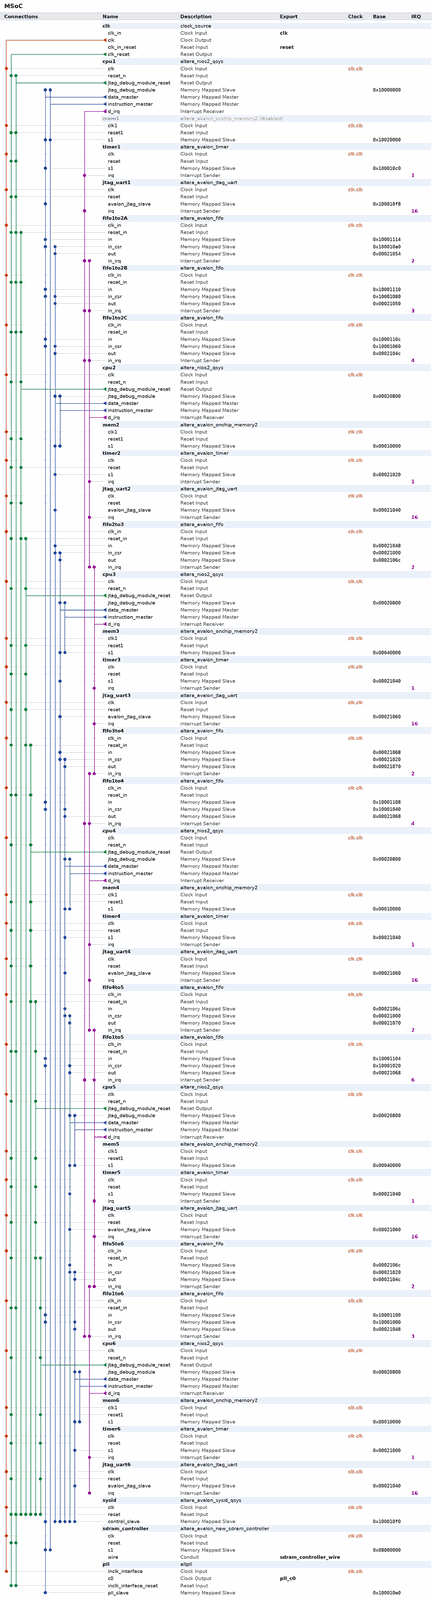
[diagram p0: system contents, whole]
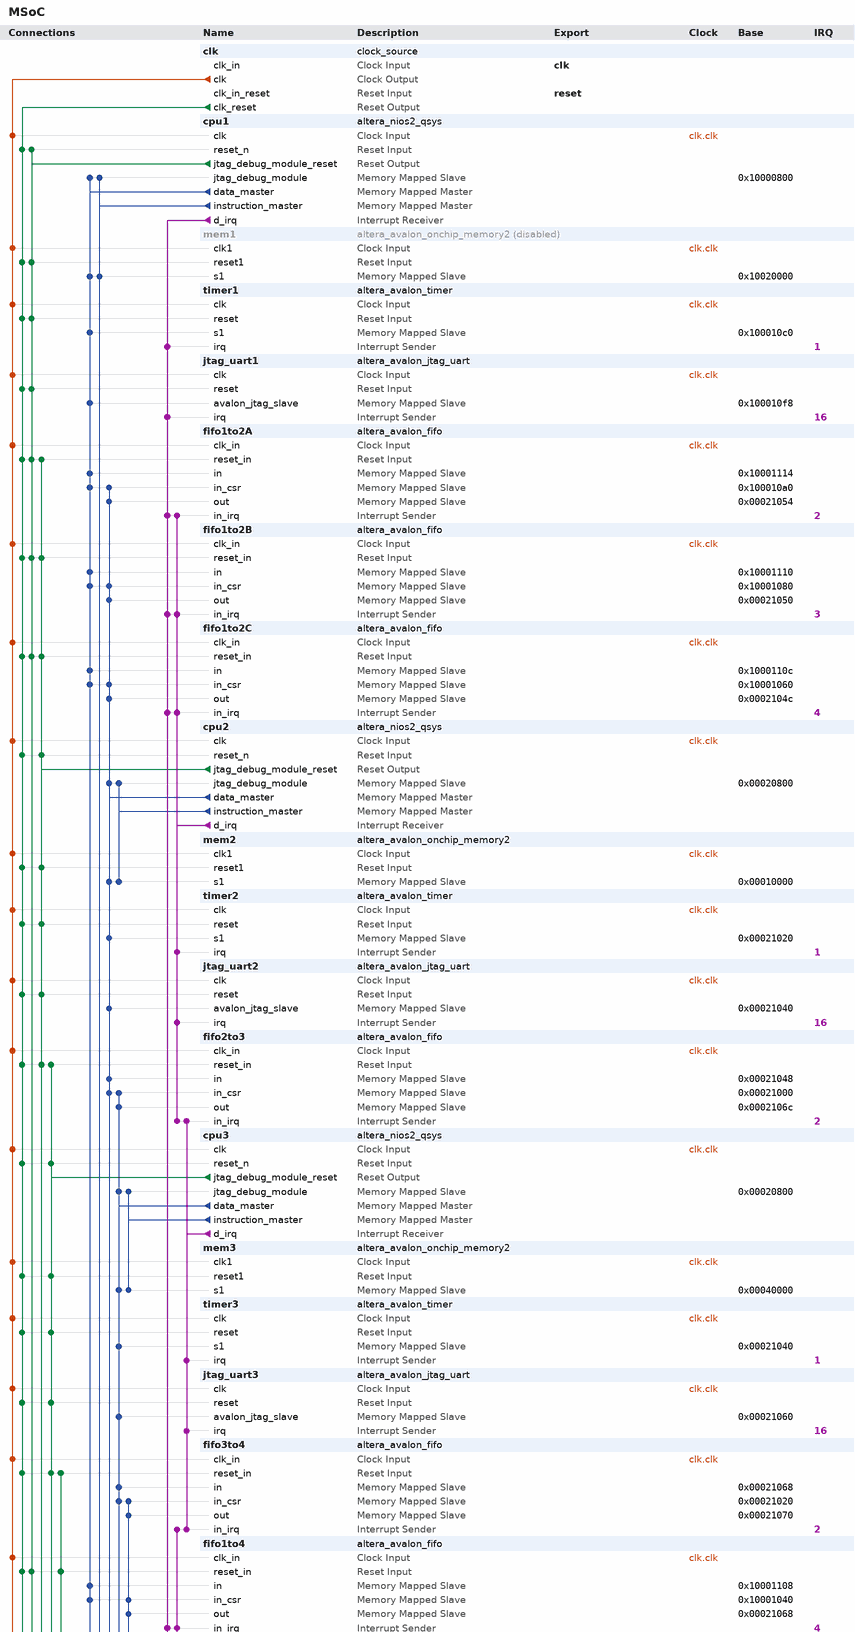
[diagram p1: system contents, upper part]
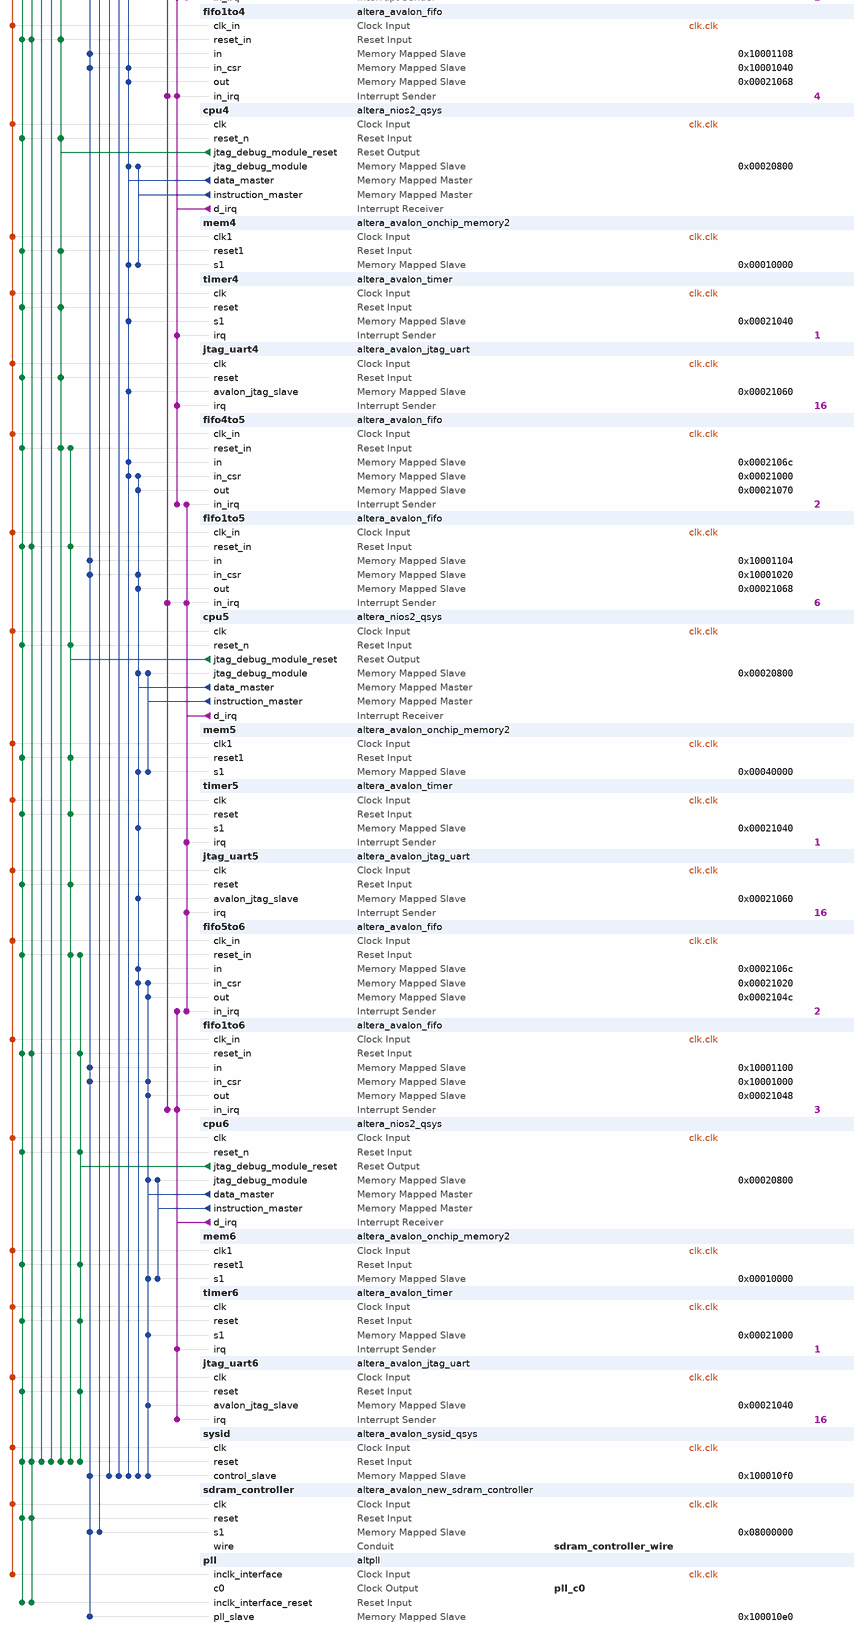
[diagram p2: system contents, lower part]
# Platform Designer (Qsys) system MSoC, Cyclone IV E EP4CE115F29C7
# Parameters at their usual value, and those the tool derives, are not listed.
package require -exact qsys 13.1
create_system MSoC
set_project_property DEVICE_FAMILY {Cyclone IV E}
set_project_property DEVICE EP4CE115F29C7

add_instance clk clock_source 13.1
set_instance_parameter_value clk clockFrequency 50000000

add_instance cpu1 altera_nios2_qsys 13.1
set_instance_parameter_value cpu1 resetSlave sdram_controller.s1
set_instance_parameter_value cpu1 mmu_TLBMissExcSlave None
set_instance_parameter_value cpu1 exceptionSlave sdram_controller.s1
set_instance_parameter_value cpu1 breakSlave cpu1.jtag_debug_module
set_instance_parameter_value cpu1 impl Tiny
set_instance_parameter_value cpu1 icache_size 4096

add_instance mem1 altera_avalon_onchip_memory2 13.1
set_instance_property mem1 ENABLED false
set_instance_parameter_value mem1 dataWidth 32
set_instance_parameter_value mem1 dualPort false
set_instance_parameter_value mem1 initMemContent true
set_instance_parameter_value mem1 initializationFileName onchip_mem.hex
set_instance_parameter_value mem1 memorySize 131072

add_instance timer1 altera_avalon_timer 13.1
set_instance_parameter_value timer1 period 1
set_instance_parameter_value timer1 periodUnits MSEC

add_instance jtag_uart1 altera_avalon_jtag_uart 13.1
set_instance_parameter_value jtag_uart1 simInteractiveOptions NO_INTERACTIVE_WINDOWS

add_instance fifo1to2A altera_avalon_fifo 13.1
set_instance_parameter_value fifo1to2A bitsPerSymbol 16
set_instance_parameter_value fifo1to2A channelWidth 8
set_instance_parameter_value fifo1to2A errorWidth 8
set_instance_parameter_value fifo1to2A fifoDepth 8
set_instance_parameter_value fifo1to2A fifoInputInterfaceOptions AVALONMM_WRITE
set_instance_parameter_value fifo1to2A fifoOutputInterfaceOptions AVALONMM_READ
set_instance_parameter_value fifo1to2A singleClockMode true
set_instance_parameter_value fifo1to2A symbolsPerBeat 2
set_instance_parameter_value fifo1to2A useIRQ true
set_instance_parameter_value fifo1to2A usePacket true
set_instance_parameter_value fifo1to2A useReadControl false

add_instance fifo1to2B altera_avalon_fifo 13.1
set_instance_parameter_value fifo1to2B bitsPerSymbol 16
set_instance_parameter_value fifo1to2B channelWidth 8
set_instance_parameter_value fifo1to2B errorWidth 8
set_instance_parameter_value fifo1to2B fifoDepth 8
set_instance_parameter_value fifo1to2B fifoInputInterfaceOptions AVALONMM_WRITE
set_instance_parameter_value fifo1to2B fifoOutputInterfaceOptions AVALONMM_READ
set_instance_parameter_value fifo1to2B singleClockMode true
set_instance_parameter_value fifo1to2B symbolsPerBeat 2
set_instance_parameter_value fifo1to2B useIRQ true
set_instance_parameter_value fifo1to2B usePacket true
set_instance_parameter_value fifo1to2B useReadControl false

add_instance fifo1to2C altera_avalon_fifo 13.1
set_instance_parameter_value fifo1to2C bitsPerSymbol 16
set_instance_parameter_value fifo1to2C channelWidth 8
set_instance_parameter_value fifo1to2C errorWidth 8
set_instance_parameter_value fifo1to2C fifoDepth 8
set_instance_parameter_value fifo1to2C fifoInputInterfaceOptions AVALONMM_WRITE
set_instance_parameter_value fifo1to2C fifoOutputInterfaceOptions AVALONMM_READ
set_instance_parameter_value fifo1to2C singleClockMode true
set_instance_parameter_value fifo1to2C symbolsPerBeat 2
set_instance_parameter_value fifo1to2C useIRQ true
set_instance_parameter_value fifo1to2C usePacket true
set_instance_parameter_value fifo1to2C useReadControl false

add_instance cpu2 altera_nios2_qsys 13.1
set_instance_parameter_value cpu2 resetSlave mem2.s1
set_instance_parameter_value cpu2 mmu_TLBMissExcSlave None
set_instance_parameter_value cpu2 exceptionSlave mem2.s1
set_instance_parameter_value cpu2 breakSlave cpu2.jtag_debug_module
set_instance_parameter_value cpu2 impl Tiny
set_instance_parameter_value cpu2 icache_size 4096

add_instance mem2 altera_avalon_onchip_memory2 13.1
set_instance_parameter_value mem2 dataWidth 32
set_instance_parameter_value mem2 dualPort false
set_instance_parameter_value mem2 initMemContent true
set_instance_parameter_value mem2 initializationFileName onchip_mem.hex
set_instance_parameter_value mem2 memorySize 65536

add_instance timer2 altera_avalon_timer 13.1
set_instance_parameter_value timer2 period 1
set_instance_parameter_value timer2 periodUnits MSEC

add_instance jtag_uart2 altera_avalon_jtag_uart 13.1
set_instance_parameter_value jtag_uart2 simInteractiveOptions NO_INTERACTIVE_WINDOWS

add_instance fifo2to3 altera_avalon_fifo 13.1
set_instance_parameter_value fifo2to3 bitsPerSymbol 16
set_instance_parameter_value fifo2to3 channelWidth 8
set_instance_parameter_value fifo2to3 errorWidth 8
set_instance_parameter_value fifo2to3 fifoDepth 8
set_instance_parameter_value fifo2to3 fifoInputInterfaceOptions AVALONMM_WRITE
set_instance_parameter_value fifo2to3 fifoOutputInterfaceOptions AVALONMM_READ
set_instance_parameter_value fifo2to3 singleClockMode true
set_instance_parameter_value fifo2to3 symbolsPerBeat 2
set_instance_parameter_value fifo2to3 useIRQ true
set_instance_parameter_value fifo2to3 usePacket true
set_instance_parameter_value fifo2to3 useReadControl false

add_instance cpu3 altera_nios2_qsys 13.1
set_instance_parameter_value cpu3 resetSlave mem3.s1
set_instance_parameter_value cpu3 mmu_TLBMissExcSlave None
set_instance_parameter_value cpu3 exceptionSlave mem3.s1
set_instance_parameter_value cpu3 breakSlave cpu3.jtag_debug_module
set_instance_parameter_value cpu3 impl Tiny
set_instance_parameter_value cpu3 icache_size 4096

add_instance mem3 altera_avalon_onchip_memory2 13.1
set_instance_parameter_value mem3 dataWidth 32
set_instance_parameter_value mem3 dualPort false
set_instance_parameter_value mem3 initMemContent true
set_instance_parameter_value mem3 initializationFileName onchip_mem.hex
set_instance_parameter_value mem3 memorySize 94208

add_instance timer3 altera_avalon_timer 13.1
set_instance_parameter_value timer3 period 1
set_instance_parameter_value timer3 periodUnits MSEC

add_instance jtag_uart3 altera_avalon_jtag_uart 13.1
set_instance_parameter_value jtag_uart3 simInteractiveOptions NO_INTERACTIVE_WINDOWS

add_instance fifo3to4 altera_avalon_fifo 13.1
set_instance_parameter_value fifo3to4 bitsPerSymbol 16
set_instance_parameter_value fifo3to4 channelWidth 8
set_instance_parameter_value fifo3to4 errorWidth 8
set_instance_parameter_value fifo3to4 fifoDepth 8
set_instance_parameter_value fifo3to4 fifoInputInterfaceOptions AVALONMM_WRITE
set_instance_parameter_value fifo3to4 fifoOutputInterfaceOptions AVALONMM_READ
set_instance_parameter_value fifo3to4 singleClockMode true
set_instance_parameter_value fifo3to4 symbolsPerBeat 2
set_instance_parameter_value fifo3to4 useIRQ true
set_instance_parameter_value fifo3to4 usePacket true
set_instance_parameter_value fifo3to4 useReadControl false

add_instance fifo1to4 altera_avalon_fifo 13.1
set_instance_parameter_value fifo1to4 bitsPerSymbol 16
set_instance_parameter_value fifo1to4 channelWidth 8
set_instance_parameter_value fifo1to4 errorWidth 8
set_instance_parameter_value fifo1to4 fifoDepth 8
set_instance_parameter_value fifo1to4 fifoInputInterfaceOptions AVALONMM_WRITE
set_instance_parameter_value fifo1to4 fifoOutputInterfaceOptions AVALONMM_READ
set_instance_parameter_value fifo1to4 singleClockMode true
set_instance_parameter_value fifo1to4 symbolsPerBeat 2
set_instance_parameter_value fifo1to4 useIRQ true
set_instance_parameter_value fifo1to4 usePacket true
set_instance_parameter_value fifo1to4 useReadControl false

add_instance cpu4 altera_nios2_qsys 13.1
set_instance_parameter_value cpu4 resetSlave mem4.s1
set_instance_parameter_value cpu4 mmu_TLBMissExcSlave None
set_instance_parameter_value cpu4 exceptionSlave mem4.s1
set_instance_parameter_value cpu4 breakSlave cpu4.jtag_debug_module
set_instance_parameter_value cpu4 impl Tiny
set_instance_parameter_value cpu4 icache_size 4096

add_instance mem4 altera_avalon_onchip_memory2 13.1
set_instance_parameter_value mem4 dataWidth 32
set_instance_parameter_value mem4 dualPort false
set_instance_parameter_value mem4 initMemContent true
set_instance_parameter_value mem4 initializationFileName onchip_mem.hex
set_instance_parameter_value mem4 memorySize 65536

add_instance timer4 altera_avalon_timer 13.1
set_instance_parameter_value timer4 period 1
set_instance_parameter_value timer4 periodUnits MSEC

add_instance jtag_uart4 altera_avalon_jtag_uart 13.1
set_instance_parameter_value jtag_uart4 simInteractiveOptions NO_INTERACTIVE_WINDOWS

add_instance fifo4to5 altera_avalon_fifo 13.1
set_instance_parameter_value fifo4to5 bitsPerSymbol 16
set_instance_parameter_value fifo4to5 channelWidth 8
set_instance_parameter_value fifo4to5 errorWidth 8
set_instance_parameter_value fifo4to5 fifoDepth 8
set_instance_parameter_value fifo4to5 fifoInputInterfaceOptions AVALONMM_WRITE
set_instance_parameter_value fifo4to5 fifoOutputInterfaceOptions AVALONMM_READ
set_instance_parameter_value fifo4to5 singleClockMode true
set_instance_parameter_value fifo4to5 symbolsPerBeat 2
set_instance_parameter_value fifo4to5 useIRQ true
set_instance_parameter_value fifo4to5 usePacket true
set_instance_parameter_value fifo4to5 useReadControl false

add_instance fifo1to5 altera_avalon_fifo 13.1
set_instance_parameter_value fifo1to5 bitsPerSymbol 16
set_instance_parameter_value fifo1to5 channelWidth 8
set_instance_parameter_value fifo1to5 errorWidth 8
set_instance_parameter_value fifo1to5 fifoDepth 8
set_instance_parameter_value fifo1to5 fifoInputInterfaceOptions AVALONMM_WRITE
set_instance_parameter_value fifo1to5 fifoOutputInterfaceOptions AVALONMM_READ
set_instance_parameter_value fifo1to5 singleClockMode true
set_instance_parameter_value fifo1to5 symbolsPerBeat 2
set_instance_parameter_value fifo1to5 useIRQ true
set_instance_parameter_value fifo1to5 usePacket true
set_instance_parameter_value fifo1to5 useReadControl false

add_instance cpu5 altera_nios2_qsys 13.1
set_instance_parameter_value cpu5 resetSlave mem5.s1
set_instance_parameter_value cpu5 mmu_TLBMissExcSlave None
set_instance_parameter_value cpu5 exceptionSlave mem5.s1
set_instance_parameter_value cpu5 breakSlave cpu5.jtag_debug_module
set_instance_parameter_value cpu5 impl Tiny
set_instance_parameter_value cpu5 icache_size 4096

add_instance mem5 altera_avalon_onchip_memory2 13.1
set_instance_parameter_value mem5 dataWidth 32
set_instance_parameter_value mem5 dualPort false
set_instance_parameter_value mem5 initMemContent true
set_instance_parameter_value mem5 initializationFileName onchip_mem.hex
set_instance_parameter_value mem5 memorySize 94208

add_instance timer5 altera_avalon_timer 13.1
set_instance_parameter_value timer5 period 1
set_instance_parameter_value timer5 periodUnits MSEC

add_instance jtag_uart5 altera_avalon_jtag_uart 13.1
set_instance_parameter_value jtag_uart5 simInteractiveOptions NO_INTERACTIVE_WINDOWS

add_instance fifo5to6 altera_avalon_fifo 13.1
set_instance_parameter_value fifo5to6 bitsPerSymbol 16
set_instance_parameter_value fifo5to6 channelWidth 8
set_instance_parameter_value fifo5to6 errorWidth 8
set_instance_parameter_value fifo5to6 fifoDepth 8
set_instance_parameter_value fifo5to6 fifoInputInterfaceOptions AVALONMM_WRITE
set_instance_parameter_value fifo5to6 fifoOutputInterfaceOptions AVALONMM_READ
set_instance_parameter_value fifo5to6 singleClockMode true
set_instance_parameter_value fifo5to6 symbolsPerBeat 2
set_instance_parameter_value fifo5to6 useIRQ true
set_instance_parameter_value fifo5to6 usePacket true
set_instance_parameter_value fifo5to6 useReadControl false

add_instance fifo1to6 altera_avalon_fifo 13.1
set_instance_parameter_value fifo1to6 bitsPerSymbol 16
set_instance_parameter_value fifo1to6 channelWidth 8
set_instance_parameter_value fifo1to6 errorWidth 8
set_instance_parameter_value fifo1to6 fifoDepth 8
set_instance_parameter_value fifo1to6 fifoInputInterfaceOptions AVALONMM_WRITE
set_instance_parameter_value fifo1to6 fifoOutputInterfaceOptions AVALONMM_READ
set_instance_parameter_value fifo1to6 singleClockMode true
set_instance_parameter_value fifo1to6 symbolsPerBeat 2
set_instance_parameter_value fifo1to6 useIRQ true
set_instance_parameter_value fifo1to6 usePacket true
set_instance_parameter_value fifo1to6 useReadControl false

add_instance cpu6 altera_nios2_qsys 13.1
set_instance_parameter_value cpu6 resetSlave mem6.s1
set_instance_parameter_value cpu6 mmu_TLBMissExcSlave None
set_instance_parameter_value cpu6 exceptionSlave mem6.s1
set_instance_parameter_value cpu6 breakSlave cpu6.jtag_debug_module
set_instance_parameter_value cpu6 impl Tiny
set_instance_parameter_value cpu6 icache_size 4096

add_instance mem6 altera_avalon_onchip_memory2 13.1
set_instance_parameter_value mem6 dataWidth 32
set_instance_parameter_value mem6 dualPort false
set_instance_parameter_value mem6 initMemContent true
set_instance_parameter_value mem6 initializationFileName onchip_mem.hex
set_instance_parameter_value mem6 memorySize 65536

add_instance timer6 altera_avalon_timer 13.1
set_instance_parameter_value timer6 period 1
set_instance_parameter_value timer6 periodUnits MSEC

add_instance jtag_uart6 altera_avalon_jtag_uart 13.1
set_instance_parameter_value jtag_uart6 simInteractiveOptions NO_INTERACTIVE_WINDOWS

add_instance sysid altera_avalon_sysid_qsys 13.1
set_instance_parameter_value sysid id 4

add_instance sdram_controller altera_avalon_new_sdram_controller 13.1
set_instance_parameter_value sdram_controller TAC 6.0
set_instance_parameter_value sdram_controller TRCD 20.0
set_instance_parameter_value sdram_controller TRP 20.0
set_instance_parameter_value sdram_controller casLatency 3
set_instance_parameter_value sdram_controller columnWidth 10
set_instance_parameter_value sdram_controller dataWidth 32
set_instance_parameter_value sdram_controller generateSimulationModel false
set_instance_parameter_value sdram_controller model single_Micron_MT48LC4M32B2_7_chip
set_instance_parameter_value sdram_controller numberOfBanks 4
set_instance_parameter_value sdram_controller numberOfChipSelects 1
set_instance_parameter_value sdram_controller powerUpDelay 100.0
set_instance_parameter_value sdram_controller refreshPeriod 15.625
set_instance_parameter_value sdram_controller rowWidth 13

add_instance pll altpll 13.1
set_instance_parameter_value pll INCLK0_INPUT_FREQUENCY 20000
set_instance_parameter_value pll CLK0_MULTIPLY_BY 1
set_instance_parameter_value pll CLK0_DIVIDE_BY 1
set_instance_parameter_value pll CLK0_PHASE_SHIFT -3611
set_instance_parameter_value pll PORT_clk1 PORT_UNUSED
set_instance_parameter_value pll PORT_clk2 PORT_UNUSED
set_instance_parameter_value pll PORT_clk3 PORT_UNUSED
set_instance_parameter_value pll PORT_ARESET PORT_UNUSED
set_instance_parameter_value pll PORT_LOCKED PORT_UNUSED

# connections
add_connection clk.clk cpu1.clk clock
add_connection clk.clk cpu2.clk clock
add_connection clk.clk cpu3.clk clock
add_connection clk.clk cpu4.clk clock
add_connection clk.clk cpu5.clk clock
add_connection clk.clk cpu6.clk clock
add_connection clk.clk fifo1to2A.clk_in clock
add_connection clk.clk fifo1to2B.clk_in clock
add_connection clk.clk fifo1to2C.clk_in clock
add_connection clk.clk fifo1to4.clk_in clock
add_connection clk.clk fifo1to5.clk_in clock
add_connection clk.clk fifo1to6.clk_in clock
add_connection clk.clk fifo2to3.clk_in clock
add_connection clk.clk fifo3to4.clk_in clock
add_connection clk.clk fifo4to5.clk_in clock
add_connection clk.clk fifo5to6.clk_in clock
add_connection clk.clk jtag_uart1.clk clock
add_connection clk.clk jtag_uart2.clk clock
add_connection clk.clk jtag_uart3.clk clock
add_connection clk.clk jtag_uart4.clk clock
add_connection clk.clk jtag_uart5.clk clock
add_connection clk.clk jtag_uart6.clk clock
add_connection clk.clk mem1.clk1 clock
add_connection clk.clk mem2.clk1 clock
add_connection clk.clk mem3.clk1 clock
add_connection clk.clk mem4.clk1 clock
add_connection clk.clk mem5.clk1 clock
add_connection clk.clk mem6.clk1 clock
add_connection clk.clk pll.inclk_interface clock
add_connection clk.clk sdram_controller.clk clock
add_connection clk.clk sysid.clk clock
add_connection clk.clk timer1.clk clock
add_connection clk.clk timer2.clk clock
add_connection clk.clk timer3.clk clock
add_connection clk.clk timer4.clk clock
add_connection clk.clk timer5.clk clock
add_connection clk.clk timer6.clk clock
add_connection clk.clk_reset cpu1.reset_n reset
add_connection clk.clk_reset cpu2.reset_n reset
add_connection clk.clk_reset cpu3.reset_n reset
add_connection clk.clk_reset cpu4.reset_n reset
add_connection clk.clk_reset cpu5.reset_n reset
add_connection clk.clk_reset cpu6.reset_n reset
add_connection clk.clk_reset fifo1to2A.reset_in reset
add_connection clk.clk_reset fifo1to2B.reset_in reset
add_connection clk.clk_reset fifo1to2C.reset_in reset
add_connection clk.clk_reset fifo1to4.reset_in reset
add_connection clk.clk_reset fifo1to5.reset_in reset
add_connection clk.clk_reset fifo1to6.reset_in reset
add_connection clk.clk_reset fifo2to3.reset_in reset
add_connection clk.clk_reset fifo3to4.reset_in reset
add_connection clk.clk_reset fifo4to5.reset_in reset
add_connection clk.clk_reset fifo5to6.reset_in reset
add_connection clk.clk_reset jtag_uart1.reset reset
add_connection clk.clk_reset jtag_uart2.reset reset
add_connection clk.clk_reset jtag_uart3.reset reset
add_connection clk.clk_reset jtag_uart4.reset reset
add_connection clk.clk_reset jtag_uart5.reset reset
add_connection clk.clk_reset jtag_uart6.reset reset
add_connection clk.clk_reset mem1.reset1 reset
add_connection clk.clk_reset mem2.reset1 reset
add_connection clk.clk_reset mem3.reset1 reset
add_connection clk.clk_reset mem4.reset1 reset
add_connection clk.clk_reset mem5.reset1 reset
add_connection clk.clk_reset mem6.reset1 reset
add_connection clk.clk_reset pll.inclk_interface_reset reset
add_connection clk.clk_reset sdram_controller.reset reset
add_connection clk.clk_reset sysid.reset reset
add_connection clk.clk_reset timer1.reset reset
add_connection clk.clk_reset timer2.reset reset
add_connection clk.clk_reset timer3.reset reset
add_connection clk.clk_reset timer4.reset reset
add_connection clk.clk_reset timer5.reset reset
add_connection clk.clk_reset timer6.reset reset
add_connection cpu1.jtag_debug_module_reset cpu1.reset_n reset
add_connection cpu1.jtag_debug_module_reset fifo1to2A.reset_in reset
add_connection cpu1.jtag_debug_module_reset fifo1to2B.reset_in reset
add_connection cpu1.jtag_debug_module_reset fifo1to2C.reset_in reset
add_connection cpu1.jtag_debug_module_reset fifo1to4.reset_in reset
add_connection cpu1.jtag_debug_module_reset fifo1to5.reset_in reset
add_connection cpu1.jtag_debug_module_reset fifo1to6.reset_in reset
add_connection cpu1.jtag_debug_module_reset jtag_uart1.reset reset
add_connection cpu1.jtag_debug_module_reset mem1.reset1 reset
add_connection cpu1.jtag_debug_module_reset pll.inclk_interface_reset reset
add_connection cpu1.jtag_debug_module_reset sdram_controller.reset reset
add_connection cpu1.jtag_debug_module_reset sysid.reset reset
add_connection cpu1.jtag_debug_module_reset timer1.reset reset
add_connection cpu2.jtag_debug_module_reset cpu2.reset_n reset
add_connection cpu2.jtag_debug_module_reset fifo1to2A.reset_in reset
add_connection cpu2.jtag_debug_module_reset fifo1to2B.reset_in reset
add_connection cpu2.jtag_debug_module_reset fifo1to2C.reset_in reset
add_connection cpu2.jtag_debug_module_reset fifo2to3.reset_in reset
add_connection cpu2.jtag_debug_module_reset jtag_uart2.reset reset
add_connection cpu2.jtag_debug_module_reset mem2.reset1 reset
add_connection cpu2.jtag_debug_module_reset sysid.reset reset
add_connection cpu2.jtag_debug_module_reset timer2.reset reset
add_connection cpu3.jtag_debug_module_reset cpu3.reset_n reset
add_connection cpu3.jtag_debug_module_reset fifo2to3.reset_in reset
add_connection cpu3.jtag_debug_module_reset fifo3to4.reset_in reset
add_connection cpu3.jtag_debug_module_reset jtag_uart3.reset reset
add_connection cpu3.jtag_debug_module_reset mem3.reset1 reset
add_connection cpu3.jtag_debug_module_reset sysid.reset reset
add_connection cpu3.jtag_debug_module_reset timer3.reset reset
add_connection cpu4.jtag_debug_module_reset cpu4.reset_n reset
add_connection cpu4.jtag_debug_module_reset fifo1to4.reset_in reset
add_connection cpu4.jtag_debug_module_reset fifo3to4.reset_in reset
add_connection cpu4.jtag_debug_module_reset fifo4to5.reset_in reset
add_connection cpu4.jtag_debug_module_reset jtag_uart4.reset reset
add_connection cpu4.jtag_debug_module_reset mem4.reset1 reset
add_connection cpu4.jtag_debug_module_reset sysid.reset reset
add_connection cpu4.jtag_debug_module_reset timer4.reset reset
add_connection cpu5.jtag_debug_module_reset cpu5.reset_n reset
add_connection cpu5.jtag_debug_module_reset fifo1to5.reset_in reset
add_connection cpu5.jtag_debug_module_reset fifo4to5.reset_in reset
add_connection cpu5.jtag_debug_module_reset fifo5to6.reset_in reset
add_connection cpu5.jtag_debug_module_reset jtag_uart5.reset reset
add_connection cpu5.jtag_debug_module_reset mem5.reset1 reset
add_connection cpu5.jtag_debug_module_reset sysid.reset reset
add_connection cpu5.jtag_debug_module_reset timer5.reset reset
add_connection cpu6.jtag_debug_module_reset cpu6.reset_n reset
add_connection cpu6.jtag_debug_module_reset fifo1to6.reset_in reset
add_connection cpu6.jtag_debug_module_reset fifo5to6.reset_in reset
add_connection cpu6.jtag_debug_module_reset jtag_uart6.reset reset
add_connection cpu6.jtag_debug_module_reset mem6.reset1 reset
add_connection cpu6.jtag_debug_module_reset sysid.reset reset
add_connection cpu6.jtag_debug_module_reset timer6.reset reset
add_connection cpu1.data_master cpu1.jtag_debug_module avalon
set_connection_parameter_value cpu1.data_master/cpu1.jtag_debug_module baseAddress 0x10000800
add_connection cpu1.data_master fifo1to2A.in avalon
set_connection_parameter_value cpu1.data_master/fifo1to2A.in baseAddress 0x10001114
add_connection cpu1.data_master fifo1to2A.in_csr avalon
set_connection_parameter_value cpu1.data_master/fifo1to2A.in_csr baseAddress 0x100010a0
add_connection cpu1.data_master fifo1to2B.in avalon
set_connection_parameter_value cpu1.data_master/fifo1to2B.in baseAddress 0x10001110
add_connection cpu1.data_master fifo1to2B.in_csr avalon
set_connection_parameter_value cpu1.data_master/fifo1to2B.in_csr baseAddress 0x10001080
add_connection cpu1.data_master fifo1to2C.in avalon
set_connection_parameter_value cpu1.data_master/fifo1to2C.in baseAddress 0x1000110c
add_connection cpu1.data_master fifo1to2C.in_csr avalon
set_connection_parameter_value cpu1.data_master/fifo1to2C.in_csr baseAddress 0x10001060
add_connection cpu1.data_master fifo1to4.in avalon
set_connection_parameter_value cpu1.data_master/fifo1to4.in baseAddress 0x10001108
add_connection cpu1.data_master fifo1to4.in_csr avalon
set_connection_parameter_value cpu1.data_master/fifo1to4.in_csr baseAddress 0x10001040
add_connection cpu1.data_master fifo1to5.in avalon
set_connection_parameter_value cpu1.data_master/fifo1to5.in baseAddress 0x10001104
add_connection cpu1.data_master fifo1to5.in_csr avalon
set_connection_parameter_value cpu1.data_master/fifo1to5.in_csr baseAddress 0x10001020
add_connection cpu1.data_master fifo1to6.in avalon
set_connection_parameter_value cpu1.data_master/fifo1to6.in baseAddress 0x10001100
add_connection cpu1.data_master fifo1to6.in_csr avalon
set_connection_parameter_value cpu1.data_master/fifo1to6.in_csr baseAddress 0x10001000
add_connection cpu1.data_master jtag_uart1.avalon_jtag_slave avalon
set_connection_parameter_value cpu1.data_master/jtag_uart1.avalon_jtag_slave baseAddress 0x100010f8
add_connection cpu1.data_master mem1.s1 avalon
set_connection_parameter_value cpu1.data_master/mem1.s1 baseAddress 0x10020000
add_connection cpu1.data_master pll.pll_slave avalon
set_connection_parameter_value cpu1.data_master/pll.pll_slave baseAddress 0x100010e0
add_connection cpu1.data_master sdram_controller.s1 avalon
set_connection_parameter_value cpu1.data_master/sdram_controller.s1 baseAddress 0x08000000
add_connection cpu1.data_master sysid.control_slave avalon
set_connection_parameter_value cpu1.data_master/sysid.control_slave baseAddress 0x100010f0
add_connection cpu1.data_master timer1.s1 avalon
set_connection_parameter_value cpu1.data_master/timer1.s1 baseAddress 0x100010c0
add_connection cpu1.instruction_master cpu1.jtag_debug_module avalon
set_connection_parameter_value cpu1.instruction_master/cpu1.jtag_debug_module baseAddress 0x10000800
add_connection cpu1.instruction_master mem1.s1 avalon
set_connection_parameter_value cpu1.instruction_master/mem1.s1 baseAddress 0x10020000
add_connection cpu1.instruction_master sdram_controller.s1 avalon
set_connection_parameter_value cpu1.instruction_master/sdram_controller.s1 baseAddress 0x08000000
add_connection cpu2.data_master cpu2.jtag_debug_module avalon
set_connection_parameter_value cpu2.data_master/cpu2.jtag_debug_module baseAddress 0x00020800
add_connection cpu2.data_master fifo1to2A.in_csr avalon
set_connection_parameter_value cpu2.data_master/fifo1to2A.in_csr baseAddress 0x100010a0
add_connection cpu2.data_master fifo1to2A.out avalon
set_connection_parameter_value cpu2.data_master/fifo1to2A.out baseAddress 0x00021054
add_connection cpu2.data_master fifo1to2B.in_csr avalon
set_connection_parameter_value cpu2.data_master/fifo1to2B.in_csr baseAddress 0x10001080
add_connection cpu2.data_master fifo1to2B.out avalon
set_connection_parameter_value cpu2.data_master/fifo1to2B.out baseAddress 0x00021050
add_connection cpu2.data_master fifo1to2C.in_csr avalon
set_connection_parameter_value cpu2.data_master/fifo1to2C.in_csr baseAddress 0x10001060
add_connection cpu2.data_master fifo1to2C.out avalon
set_connection_parameter_value cpu2.data_master/fifo1to2C.out baseAddress 0x0002104c
add_connection cpu2.data_master fifo2to3.in avalon
set_connection_parameter_value cpu2.data_master/fifo2to3.in baseAddress 0x00021048
add_connection cpu2.data_master fifo2to3.in_csr avalon
set_connection_parameter_value cpu2.data_master/fifo2to3.in_csr baseAddress 0x00021000
add_connection cpu2.data_master jtag_uart2.avalon_jtag_slave avalon
set_connection_parameter_value cpu2.data_master/jtag_uart2.avalon_jtag_slave baseAddress 0x00021040
add_connection cpu2.data_master mem2.s1 avalon
set_connection_parameter_value cpu2.data_master/mem2.s1 baseAddress 0x00010000
add_connection cpu2.data_master sysid.control_slave avalon
set_connection_parameter_value cpu2.data_master/sysid.control_slave baseAddress 0x100010f0
add_connection cpu2.data_master timer2.s1 avalon
set_connection_parameter_value cpu2.data_master/timer2.s1 baseAddress 0x00021020
add_connection cpu2.instruction_master cpu2.jtag_debug_module avalon
set_connection_parameter_value cpu2.instruction_master/cpu2.jtag_debug_module baseAddress 0x00020800
add_connection cpu2.instruction_master mem2.s1 avalon
set_connection_parameter_value cpu2.instruction_master/mem2.s1 baseAddress 0x00010000
add_connection cpu3.data_master cpu3.jtag_debug_module avalon
set_connection_parameter_value cpu3.data_master/cpu3.jtag_debug_module baseAddress 0x00020800
add_connection cpu3.data_master fifo2to3.in_csr avalon
set_connection_parameter_value cpu3.data_master/fifo2to3.in_csr baseAddress 0x00021000
add_connection cpu3.data_master fifo2to3.out avalon
set_connection_parameter_value cpu3.data_master/fifo2to3.out baseAddress 0x0002106c
add_connection cpu3.data_master fifo3to4.in avalon
set_connection_parameter_value cpu3.data_master/fifo3to4.in baseAddress 0x00021068
add_connection cpu3.data_master fifo3to4.in_csr avalon
set_connection_parameter_value cpu3.data_master/fifo3to4.in_csr baseAddress 0x00021020
add_connection cpu3.data_master jtag_uart3.avalon_jtag_slave avalon
set_connection_parameter_value cpu3.data_master/jtag_uart3.avalon_jtag_slave baseAddress 0x00021060
add_connection cpu3.data_master mem3.s1 avalon
set_connection_parameter_value cpu3.data_master/mem3.s1 baseAddress 0x00040000
add_connection cpu3.data_master sysid.control_slave avalon
set_connection_parameter_value cpu3.data_master/sysid.control_slave baseAddress 0x100010f0
add_connection cpu3.data_master timer3.s1 avalon
set_connection_parameter_value cpu3.data_master/timer3.s1 baseAddress 0x00021040
add_connection cpu3.instruction_master cpu3.jtag_debug_module avalon
set_connection_parameter_value cpu3.instruction_master/cpu3.jtag_debug_module baseAddress 0x00020800
add_connection cpu3.instruction_master mem3.s1 avalon
set_connection_parameter_value cpu3.instruction_master/mem3.s1 baseAddress 0x00040000
add_connection cpu4.data_master cpu4.jtag_debug_module avalon
set_connection_parameter_value cpu4.data_master/cpu4.jtag_debug_module baseAddress 0x00020800
add_connection cpu4.data_master fifo1to4.in_csr avalon
set_connection_parameter_value cpu4.data_master/fifo1to4.in_csr baseAddress 0x10001040
add_connection cpu4.data_master fifo1to4.out avalon
set_connection_parameter_value cpu4.data_master/fifo1to4.out baseAddress 0x00021068
add_connection cpu4.data_master fifo3to4.in_csr avalon
set_connection_parameter_value cpu4.data_master/fifo3to4.in_csr baseAddress 0x00021020
add_connection cpu4.data_master fifo3to4.out avalon
set_connection_parameter_value cpu4.data_master/fifo3to4.out baseAddress 0x00021070
add_connection cpu4.data_master fifo4to5.in avalon
set_connection_parameter_value cpu4.data_master/fifo4to5.in baseAddress 0x0002106c
add_connection cpu4.data_master fifo4to5.in_csr avalon
set_connection_parameter_value cpu4.data_master/fifo4to5.in_csr baseAddress 0x00021000
add_connection cpu4.data_master jtag_uart4.avalon_jtag_slave avalon
set_connection_parameter_value cpu4.data_master/jtag_uart4.avalon_jtag_slave baseAddress 0x00021060
add_connection cpu4.data_master mem4.s1 avalon
set_connection_parameter_value cpu4.data_master/mem4.s1 baseAddress 0x00010000
add_connection cpu4.data_master sysid.control_slave avalon
set_connection_parameter_value cpu4.data_master/sysid.control_slave baseAddress 0x100010f0
add_connection cpu4.data_master timer4.s1 avalon
set_connection_parameter_value cpu4.data_master/timer4.s1 baseAddress 0x00021040
add_connection cpu4.instruction_master cpu4.jtag_debug_module avalon
set_connection_parameter_value cpu4.instruction_master/cpu4.jtag_debug_module baseAddress 0x00020800
add_connection cpu4.instruction_master mem4.s1 avalon
set_connection_parameter_value cpu4.instruction_master/mem4.s1 baseAddress 0x00010000
add_connection cpu5.data_master cpu5.jtag_debug_module avalon
set_connection_parameter_value cpu5.data_master/cpu5.jtag_debug_module baseAddress 0x00020800
add_connection cpu5.data_master fifo1to5.in_csr avalon
set_connection_parameter_value cpu5.data_master/fifo1to5.in_csr baseAddress 0x10001020
add_connection cpu5.data_master fifo1to5.out avalon
set_connection_parameter_value cpu5.data_master/fifo1to5.out baseAddress 0x00021068
add_connection cpu5.data_master fifo4to5.in_csr avalon
set_connection_parameter_value cpu5.data_master/fifo4to5.in_csr baseAddress 0x00021000
add_connection cpu5.data_master fifo4to5.out avalon
set_connection_parameter_value cpu5.data_master/fifo4to5.out baseAddress 0x00021070
add_connection cpu5.data_master fifo5to6.in avalon
set_connection_parameter_value cpu5.data_master/fifo5to6.in baseAddress 0x0002106c
add_connection cpu5.data_master fifo5to6.in_csr avalon
set_connection_parameter_value cpu5.data_master/fifo5to6.in_csr baseAddress 0x00021020
add_connection cpu5.data_master jtag_uart5.avalon_jtag_slave avalon
set_connection_parameter_value cpu5.data_master/jtag_uart5.avalon_jtag_slave baseAddress 0x00021060
add_connection cpu5.data_master mem5.s1 avalon
set_connection_parameter_value cpu5.data_master/mem5.s1 baseAddress 0x00040000
add_connection cpu5.data_master sysid.control_slave avalon
set_connection_parameter_value cpu5.data_master/sysid.control_slave baseAddress 0x100010f0
add_connection cpu5.data_master timer5.s1 avalon
set_connection_parameter_value cpu5.data_master/timer5.s1 baseAddress 0x00021040
add_connection cpu5.instruction_master cpu5.jtag_debug_module avalon
set_connection_parameter_value cpu5.instruction_master/cpu5.jtag_debug_module baseAddress 0x00020800
add_connection cpu5.instruction_master mem5.s1 avalon
set_connection_parameter_value cpu5.instruction_master/mem5.s1 baseAddress 0x00040000
add_connection cpu6.data_master cpu6.jtag_debug_module avalon
set_connection_parameter_value cpu6.data_master/cpu6.jtag_debug_module baseAddress 0x00020800
add_connection cpu6.data_master fifo1to6.in_csr avalon
set_connection_parameter_value cpu6.data_master/fifo1to6.in_csr baseAddress 0x10001000
add_connection cpu6.data_master fifo1to6.out avalon
set_connection_parameter_value cpu6.data_master/fifo1to6.out baseAddress 0x00021048
add_connection cpu6.data_master fifo5to6.in_csr avalon
set_connection_parameter_value cpu6.data_master/fifo5to6.in_csr baseAddress 0x00021020
add_connection cpu6.data_master fifo5to6.out avalon
set_connection_parameter_value cpu6.data_master/fifo5to6.out baseAddress 0x0002104c
add_connection cpu6.data_master jtag_uart6.avalon_jtag_slave avalon
set_connection_parameter_value cpu6.data_master/jtag_uart6.avalon_jtag_slave baseAddress 0x00021040
add_connection cpu6.data_master mem6.s1 avalon
set_connection_parameter_value cpu6.data_master/mem6.s1 baseAddress 0x00010000
add_connection cpu6.data_master sysid.control_slave avalon
set_connection_parameter_value cpu6.data_master/sysid.control_slave baseAddress 0x100010f0
add_connection cpu6.data_master timer6.s1 avalon
set_connection_parameter_value cpu6.data_master/timer6.s1 baseAddress 0x00021000
add_connection cpu6.instruction_master cpu6.jtag_debug_module avalon
set_connection_parameter_value cpu6.instruction_master/cpu6.jtag_debug_module baseAddress 0x00020800
add_connection cpu6.instruction_master mem6.s1 avalon
set_connection_parameter_value cpu6.instruction_master/mem6.s1 baseAddress 0x00010000
add_connection cpu1.d_irq fifo1to2A.in_irq interrupt
set_connection_parameter_value cpu1.d_irq/fifo1to2A.in_irq irqNumber 2
add_connection cpu1.d_irq fifo1to2B.in_irq interrupt
set_connection_parameter_value cpu1.d_irq/fifo1to2B.in_irq irqNumber 3
add_connection cpu1.d_irq fifo1to2C.in_irq interrupt
set_connection_parameter_value cpu1.d_irq/fifo1to2C.in_irq irqNumber 4
add_connection cpu1.d_irq fifo1to4.in_irq interrupt
set_connection_parameter_value cpu1.d_irq/fifo1to4.in_irq irqNumber 5
add_connection cpu1.d_irq fifo1to5.in_irq interrupt
set_connection_parameter_value cpu1.d_irq/fifo1to5.in_irq irqNumber 6
add_connection cpu1.d_irq fifo1to6.in_irq interrupt
set_connection_parameter_value cpu1.d_irq/fifo1to6.in_irq irqNumber 7
add_connection cpu1.d_irq jtag_uart1.irq interrupt
set_connection_parameter_value cpu1.d_irq/jtag_uart1.irq irqNumber 16
add_connection cpu1.d_irq timer1.irq interrupt
set_connection_parameter_value cpu1.d_irq/timer1.irq irqNumber 1
add_connection cpu2.d_irq fifo1to2A.in_irq interrupt
set_connection_parameter_value cpu2.d_irq/fifo1to2A.in_irq irqNumber 2
add_connection cpu2.d_irq fifo1to2B.in_irq interrupt
set_connection_parameter_value cpu2.d_irq/fifo1to2B.in_irq irqNumber 3
add_connection cpu2.d_irq fifo1to2C.in_irq interrupt
set_connection_parameter_value cpu2.d_irq/fifo1to2C.in_irq irqNumber 4
add_connection cpu2.d_irq fifo2to3.in_irq interrupt
set_connection_parameter_value cpu2.d_irq/fifo2to3.in_irq irqNumber 5
add_connection cpu2.d_irq jtag_uart2.irq interrupt
set_connection_parameter_value cpu2.d_irq/jtag_uart2.irq irqNumber 16
add_connection cpu2.d_irq timer2.irq interrupt
set_connection_parameter_value cpu2.d_irq/timer2.irq irqNumber 1
add_connection cpu3.d_irq fifo2to3.in_irq interrupt
set_connection_parameter_value cpu3.d_irq/fifo2to3.in_irq irqNumber 2
add_connection cpu3.d_irq fifo3to4.in_irq interrupt
set_connection_parameter_value cpu3.d_irq/fifo3to4.in_irq irqNumber 3
add_connection cpu3.d_irq jtag_uart3.irq interrupt
set_connection_parameter_value cpu3.d_irq/jtag_uart3.irq irqNumber 16
add_connection cpu3.d_irq timer3.irq interrupt
set_connection_parameter_value cpu3.d_irq/timer3.irq irqNumber 1
add_connection cpu4.d_irq fifo1to4.in_irq interrupt
set_connection_parameter_value cpu4.d_irq/fifo1to4.in_irq irqNumber 4
add_connection cpu4.d_irq fifo3to4.in_irq interrupt
set_connection_parameter_value cpu4.d_irq/fifo3to4.in_irq irqNumber 2
add_connection cpu4.d_irq fifo4to5.in_irq interrupt
set_connection_parameter_value cpu4.d_irq/fifo4to5.in_irq irqNumber 3
add_connection cpu4.d_irq jtag_uart4.irq interrupt
set_connection_parameter_value cpu4.d_irq/jtag_uart4.irq irqNumber 16
add_connection cpu4.d_irq timer4.irq interrupt
set_connection_parameter_value cpu4.d_irq/timer4.irq irqNumber 1
add_connection cpu5.d_irq fifo1to5.in_irq interrupt
set_connection_parameter_value cpu5.d_irq/fifo1to5.in_irq irqNumber 4
add_connection cpu5.d_irq fifo4to5.in_irq interrupt
set_connection_parameter_value cpu5.d_irq/fifo4to5.in_irq irqNumber 2
add_connection cpu5.d_irq fifo5to6.in_irq interrupt
set_connection_parameter_value cpu5.d_irq/fifo5to6.in_irq irqNumber 3
add_connection cpu5.d_irq jtag_uart5.irq interrupt
set_connection_parameter_value cpu5.d_irq/jtag_uart5.irq irqNumber 16
add_connection cpu5.d_irq timer5.irq interrupt
set_connection_parameter_value cpu5.d_irq/timer5.irq irqNumber 1
add_connection cpu6.d_irq fifo1to6.in_irq interrupt
set_connection_parameter_value cpu6.d_irq/fifo1to6.in_irq irqNumber 3
add_connection cpu6.d_irq fifo5to6.in_irq interrupt
set_connection_parameter_value cpu6.d_irq/fifo5to6.in_irq irqNumber 2
add_connection cpu6.d_irq jtag_uart6.irq interrupt
set_connection_parameter_value cpu6.d_irq/jtag_uart6.irq irqNumber 16
add_connection cpu6.d_irq timer6.irq interrupt
set_connection_parameter_value cpu6.d_irq/timer6.irq irqNumber 1

# exported interfaces
add_interface clk clock sink
set_interface_property clk EXPORT_OF clk.clk_in
add_interface reset reset sink
set_interface_property reset EXPORT_OF clk.clk_in_reset
add_interface sdram_controller_wire conduit end
set_interface_property sdram_controller_wire EXPORT_OF sdram_controller.wire
add_interface pll_c0 clock source
set_interface_property pll_c0 EXPORT_OF pll.c0

set_interconnect_requirement {$system} qsys_mm.clockCrossingAdapter HANDSHAKE
set_interconnect_requirement {$system} qsys_mm.maxAdditionalLatency 1
set_interconnect_requirement {$system} qsys_mm.insertDefaultSlave false

save_system MSoC.qsys
